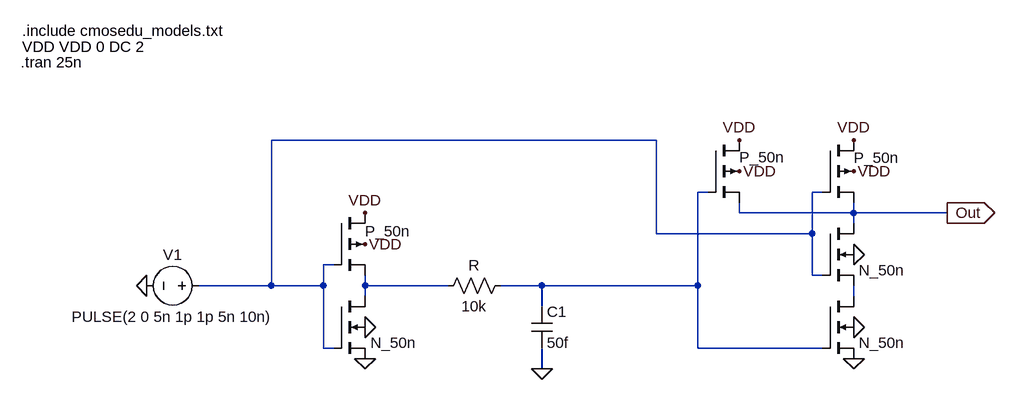
[diagram p0: schematic Ex1.asc]
Ex1.asc, the LTspice schematic file:
Version 4
SHEET 1 1560 680
WIRE 896 -176 304 -176
WIRE 976 -96 960 -96
WIRE 1152 -96 1136 -96
WIRE 1024 -64 1024 -80
WIRE 1200 -64 1200 -80
WIRE 1200 -64 1024 -64
WIRE 1344 -64 1200 -64
WIRE 1200 -48 1200 -64
WIRE 896 -32 896 -176
WIRE 1136 -32 1136 -96
WIRE 1136 -32 896 -32
WIRE 400 16 384 16
WIRE 1136 32 1136 -32
WIRE 1152 32 1136 32
WIRE 304 48 304 -176
WIRE 304 48 192 48
WIRE 384 48 384 16
WIRE 384 48 304 48
WIRE 448 48 448 32
WIRE 576 48 448 48
WIRE 720 48 656 48
WIRE 960 48 960 -96
WIRE 960 48 720 48
WIRE 448 64 448 48
WIRE 1200 64 1200 48
WIRE 720 80 720 48
WIRE 384 144 384 48
WIRE 400 144 384 144
WIRE 960 144 960 48
WIRE 1152 144 960 144
WIRE 720 176 720 144
FLAG 448 -64 VDD
FLAG 448 -16 VDD
FLAG 1024 -176 VDD
FLAG 1024 -128 VDD
FLAG 1200 -176 VDD
FLAG 1200 -128 VDD
FLAG 448 112 0
FLAG 448 160 0
FLAG 720 176 0
FLAG 112 48 0
FLAG 1200 160 0
FLAG 1200 112 0
FLAG 1200 0 0
FLAG 1344 -64 Out
IOPIN 1344 -64 Out
SYMBOL nmos4 400 64 R0
WINDOW 0 56 32 Invisible 2
SYMATTR InstName M1
SYMATTR Value N_50n
SYMATTR Value2 l=50n w=1u
SYMBOL pmos4 1152 -176 R0
WINDOW 0 56 32 Invisible 2
WINDOW 3 48 27 Left 2
SYMATTR InstName M4
SYMATTR Value P_50n
SYMATTR Value2 l=50n w=1u
SYMBOL pmos4 400 -64 R0
WINDOW 0 56 32 Invisible 2
WINDOW 3 48 28 Left 2
SYMATTR InstName M2
SYMATTR Value P_50n
SYMATTR Value2 l=50n w=1u
SYMBOL pmos4 976 -176 R0
WINDOW 0 56 32 Invisible 2
WINDOW 3 48 26 Left 2
SYMATTR InstName M3
SYMATTR Value P_50n
SYMATTR Value2 l=50n w=1u
SYMBOL nmos4 1152 -48 R0
WINDOW 0 56 32 Invisible 2
SYMATTR InstName M5
SYMATTR Value N_50n
SYMATTR Value2 l=50n w=1u
SYMBOL nmos4 1152 64 R0
WINDOW 0 56 32 Invisible 2
SYMATTR InstName M6
SYMATTR Value N_50n
SYMATTR Value2 l=50n w=1u
SYMBOL res 672 32 R90
WINDOW 0 0 56 VBottom 2
WINDOW 3 32 56 VTop 2
SYMATTR InstName R
SYMATTR Value 10k
SYMBOL cap 704 80 R0
SYMATTR InstName C1
SYMATTR Value 50f
SYMBOL voltage 208 48 R90
WINDOW 0 -32 56 VBottom 2
WINDOW 3 32 56 VTop 2
WINDOW 123 0 0 Left 0
WINDOW 39 0 0 Left 0
SYMATTR InstName V1
SYMATTR Value PULSE(2 0 5n 1p 1p 5n 10n)
TEXT -80 -344 Left 2 !.include cmosedu_models.txt
TEXT -80 -320 Left 2 !VDD VDD 0 DC 2
TEXT -82 -296 Left 2 !.tran 25n

The netlist it stands for:
* Ex1.asc
M1 N003 N001 0 0 N_50n l=50n w=1u
M4 VDD N001 Out VDD P_50n l=50n w=1u
M2 VDD N001 N003 VDD P_50n l=50n w=1u
M3 VDD N002 Out VDD P_50n l=50n w=1u
M5 Out N001 N004 0 N_50n l=50n w=1u
M6 N004 N002 0 0 N_50n l=50n w=1u
R N002 N003 10k
C1 N002 0 50f
V1 N001 0 PULSE(2 0 5n 1p 1p 5n 10n)
.model NMOS NMOS
.model PMOS PMOS
.lib standard.mos
.include cmosedu_models.txt
VDD VDD 0 DC 2
.tran 25n
.backanno
.end